# Altium schematic sheet System Overview.SchDoc
size A4; SheetNumber: 1; SheetTotal: 10
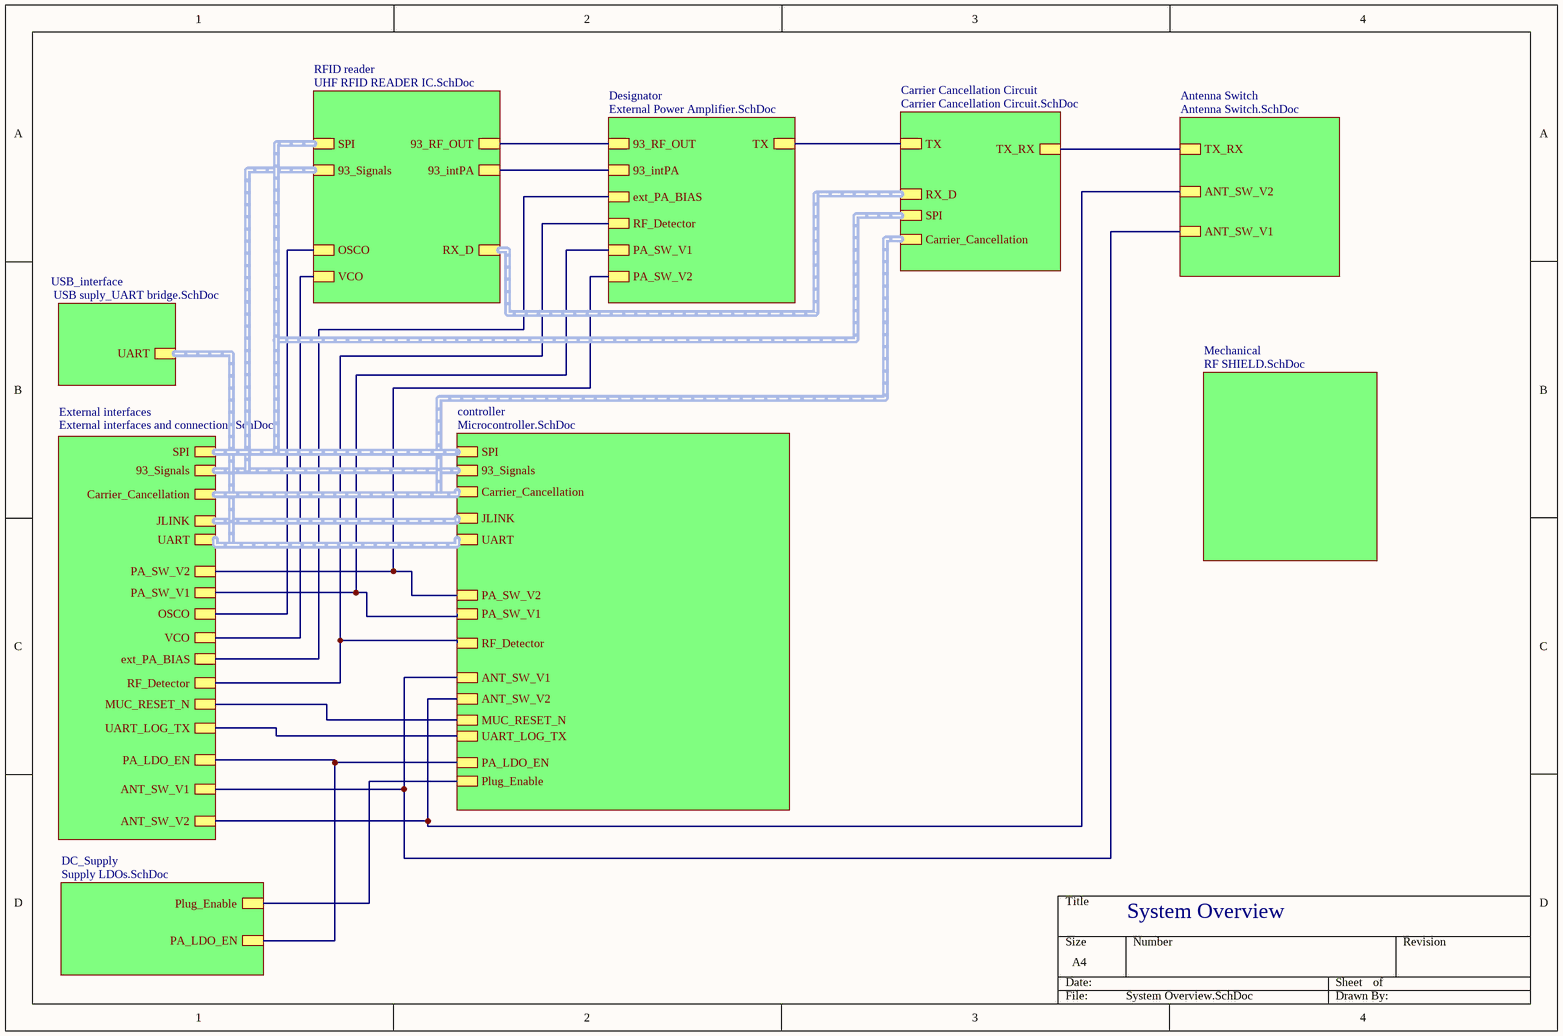
[diagram p0: System Overview.SchDoc]

## Sub-sheets
Antenna Switch = Antenna Switch.SchDoc: TX_RX, ANT_SW_V2, ANT_SW_V1
Carrier Cancellation Circuit = Carrier Cancellation Circuit.SchDoc: TX, TX_RX, RX_D (harness RX_D), SPI (harness SPI), Carrier_Cancellation (harness Carrier_Cancellation)
controller = Microcontroller.SchDoc: JLINK (harness JLINK), UART (harness UART), PA_SW_V2, PA_SW_V1, RF_Detector, ANT_SW_V2, ANT_SW_V1, MUC_RESET_N, PA_LDO_EN, SPI (harness SPI), 93_Signals (harness 93_Signals), Carrier_Cancellation (harness Carrier_Cancellation), UART_LOG_TX, Plug_Enable
DC_Supply = Supply LDOs.SchDoc: Plug_Enable, PA_LDO_EN
Designator = External Power Amplifier.SchDoc: TX, 93_RF_OUT, 93_intPA, ext_PA_BIAS, RF_Detector, PA_SW_V1, PA_SW_V2
External interfaces = External interfaces and connections.SchDoc: PA_SW_V2, PA_SW_V1, OSCO, VCO, ext_PA_BIAS, RF_Detector, MUC_RESET_N, UART_LOG_TX, PA_LDO_EN, ANT_SW_V1, ANT_SW_V2, SPI (harness SPI), 93_Signals (harness 93_Signals), Carrier_Cancellation (harness Carrier_Cancellation), JLINK (harness JLINK), UART (harness UART)
Mechanical = RF SHIELD.SchDoc: no entries
RFID reader = UHF RFID READER IC.SchDoc: 93_RF_OUT, OSCO, VCO, 93_intPA, SPI (harness SPI), 93_Signals (harness 93_Signals), RX_D (harness RX_D)
USB_interface = USB suply_UART bridge.SchDoc: UART (harness UART)

## Nets
(unnamed): sheet RFID reader/93_RF_OUT, sheet Designator/93_RF_OUT
(unnamed): sheet RFID reader/OSCO, sheet External interfaces/OSCO
(unnamed): sheet RFID reader/VCO, sheet External interfaces/VCO
(unnamed): sheet RFID reader/93_intPA, sheet Designator/93_intPA
(unnamed): sheet Designator/TX, sheet Carrier Cancellation Circuit/TX
(unnamed): sheet Designator/ext_PA_BIAS, sheet External interfaces/ext_PA_BIAS
(unnamed): sheet Designator/RF_Detector, sheet External interfaces/RF_Detector, sheet controller/RF_Detector
(unnamed): sheet Designator/PA_SW_V1, sheet External interfaces/PA_SW_V1, sheet controller/PA_SW_V1
(unnamed): sheet Designator/PA_SW_V2, sheet External interfaces/PA_SW_V2, sheet controller/PA_SW_V2
(unnamed): sheet Antenna Switch/TX_RX, sheet Carrier Cancellation Circuit/TX_RX
(unnamed): sheet Antenna Switch/ANT_SW_V2, sheet External interfaces/ANT_SW_V2, sheet controller/ANT_SW_V2
(unnamed): sheet Antenna Switch/ANT_SW_V1, sheet External interfaces/ANT_SW_V1, sheet controller/ANT_SW_V1
(unnamed): sheet External interfaces/MUC_RESET_N, sheet controller/MUC_RESET_N
(unnamed): sheet External interfaces/UART_LOG_TX, sheet controller/UART_LOG_TX
(unnamed): sheet External interfaces/PA_LDO_EN, sheet controller/PA_LDO_EN, sheet DC_Supply/PA_LDO_EN
(unnamed): sheet controller/Plug_Enable, sheet DC_Supply/Plug_Enable

## Buses and harness runs
harness sheet Carrier Cancellation Circuit/Carrier_Cancellation = sheet controller/Carrier_Cancellation = sheet External interfaces/Carrier_Cancellation
harness sheet Carrier Cancellation Circuit/RX_D = sheet RFID reader/RX_D
harness sheet Carrier Cancellation Circuit/SPI = sheet controller/SPI = sheet External interfaces/SPI = sheet RFID reader/SPI
harness sheet controller/93_Signals = sheet External interfaces/93_Signals = sheet RFID reader/93_Signals
harness sheet controller/JLINK = sheet External interfaces/JLINK
harness sheet controller/UART = sheet External interfaces/UART = sheet USB_interface/UART

## Notes on the sheet
- System Overview